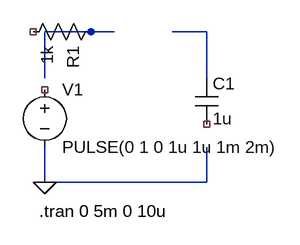
[diagram p0: schematic ltspice_rc.asc]
ltspice_rc.asc, the LTspice schematic file:
Version 4
SHEET 1 880 680
WIRE 176 96 80 96
WIRE 304 96 256 96
WIRE 304 160 304 96
WIRE 80 160 80 96
WIRE 80 304 80 256
WIRE 304 304 304 256
WIRE 304 304 80 304
FLAG 80 304 0
SYMBOL res 160 80 R90
SYMATTR InstName R1
SYMATTR Value 1k
SYMBOL cap 288 160 R0
SYMATTR InstName C1
SYMATTR Value 1u
SYMBOL voltage 80 160 R0
SYMATTR InstName V1
SYMATTR Value PULSE(0 1 0 1u 1u 1m 2m)
TEXT 72 344 Left 2 !.tran 0 5m 0 10u

The netlist it stands for:
* ltspice_rc.asc
R1 N001 NC_01 1k
C1 N002 NC_02 1u
V1 NC_03 0 PULSE(0 1 0 1u 1u 1m 2m)
.tran 0 5m 0 10u
.backanno
.end